# Altium schematic sheet [05] - QSPI FLASH.SchDoc
size A3; DocumentNumber: 5; SheetNumber: 5; SheetTotal: 18
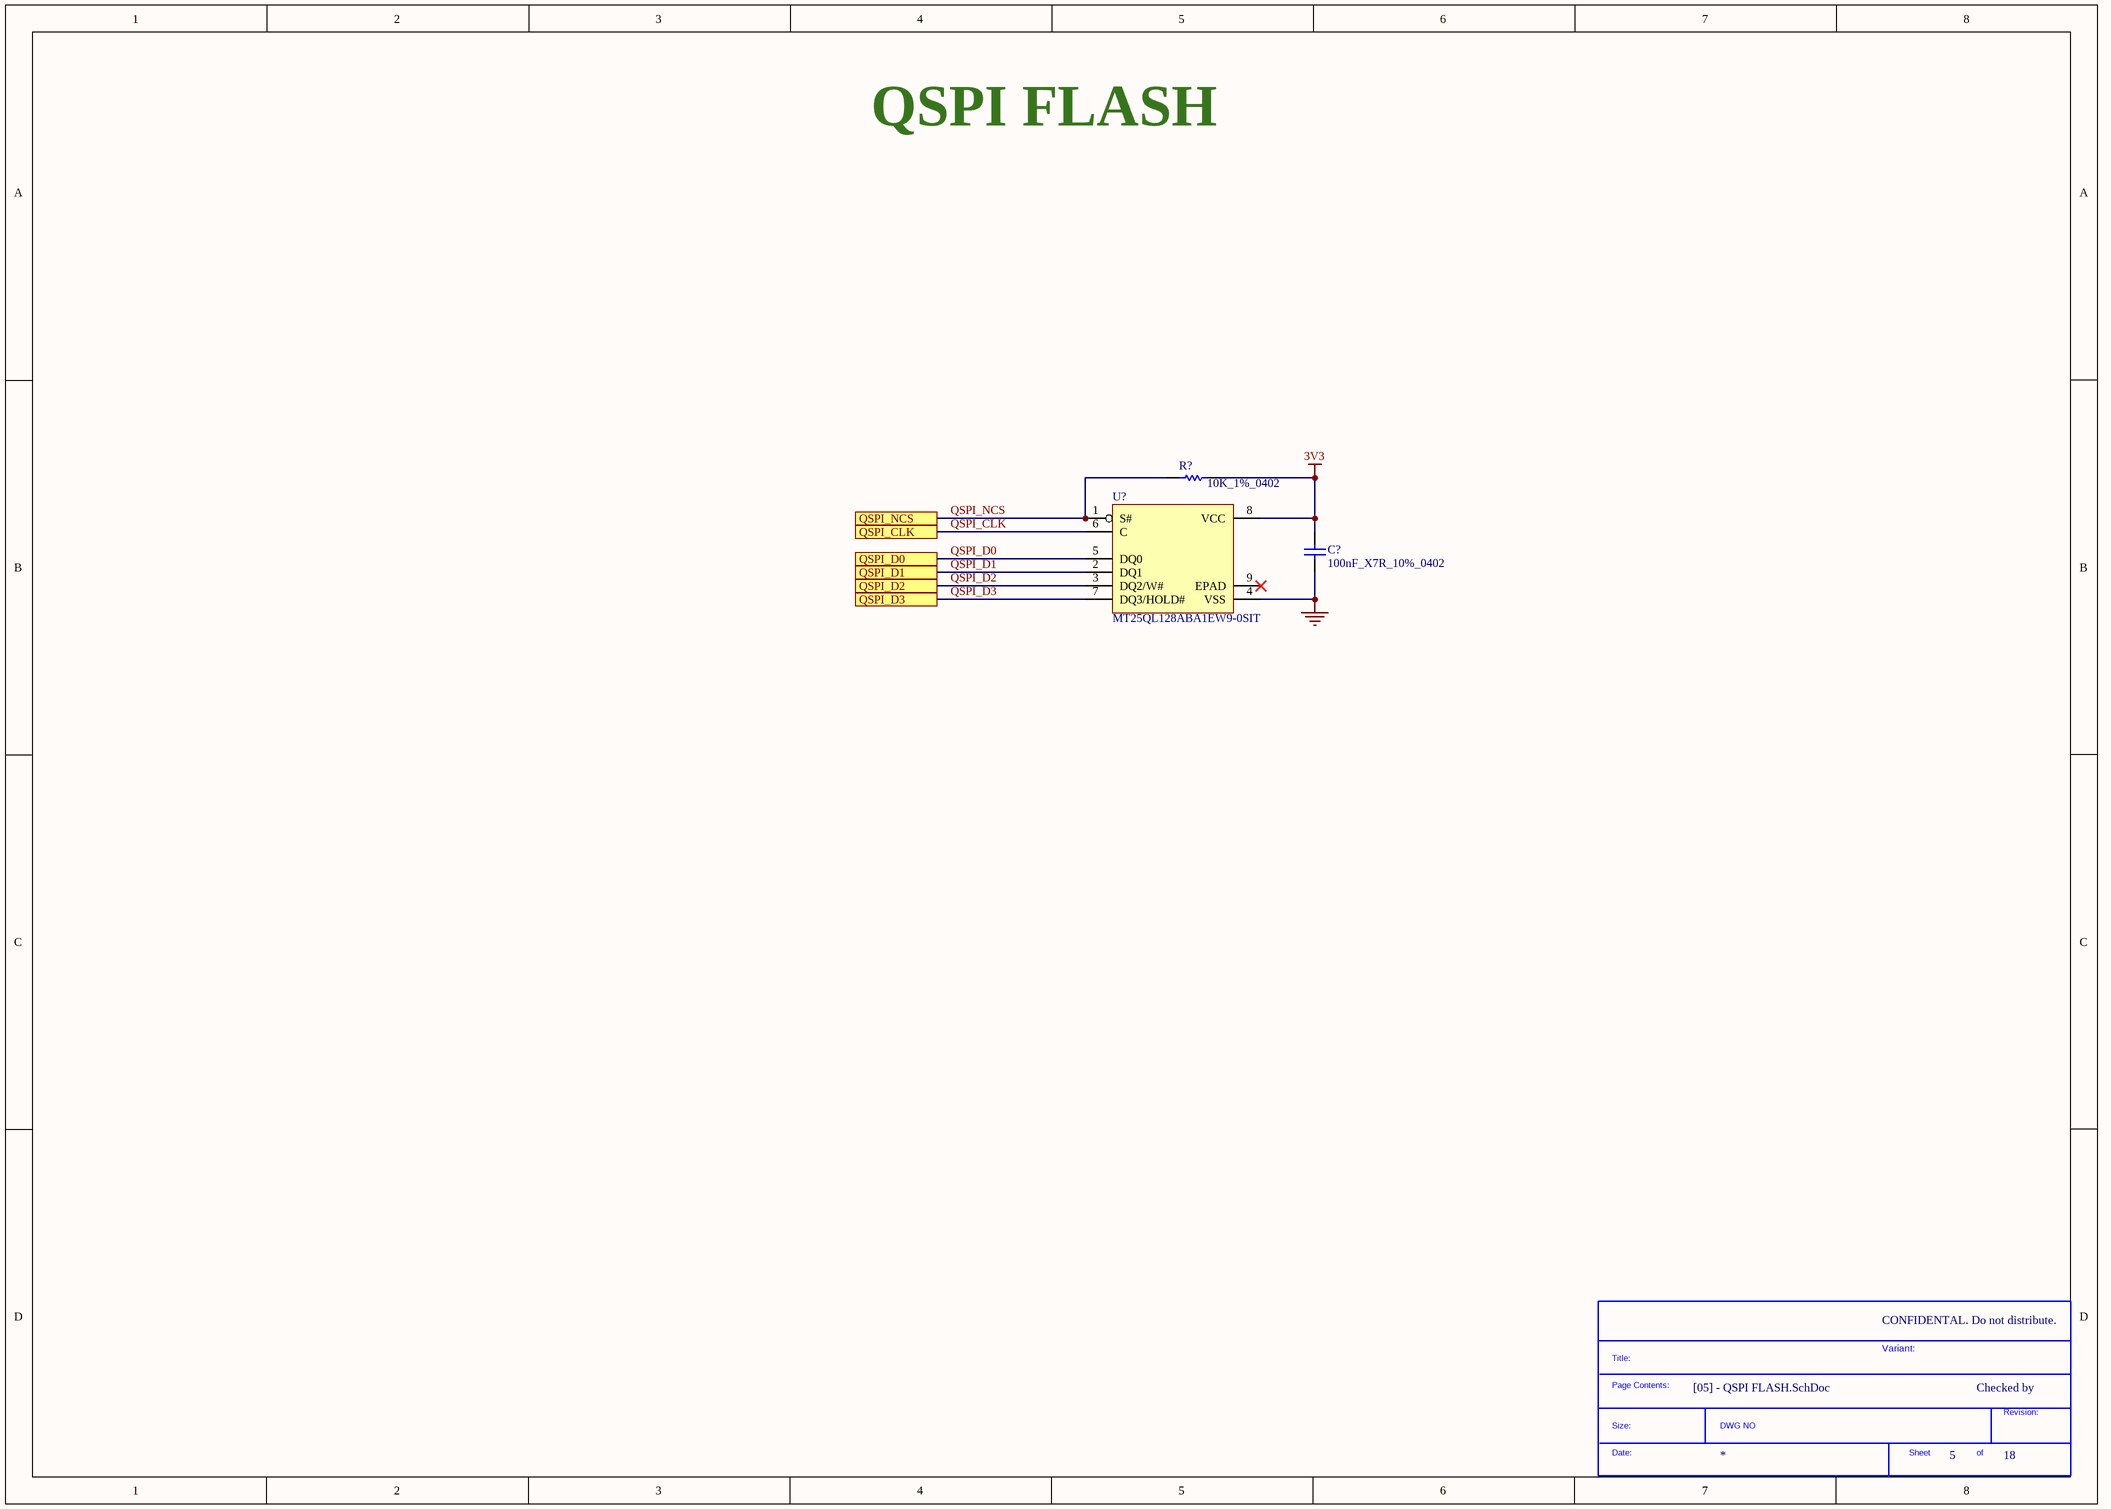
[diagram p0: [05] - QSPI FLASH.SchDoc]

## Parts
*  SDTitleBlock  (value not drawn)  (graphical)
C?  100nF_X7R_10%_0402  [0402C]
R?  10K_1%_0402  [0402R]
U?  MT25QL128ABA1EW9-0SIT  [W-PDFN-8_8X6_P127]

## Ports
QSPI_CLK, QSPI_D0, QSPI_D1, QSPI_D2, QSPI_D3, QSPI_NCS

## Nets
3V3: C?.2 R?.2 U?.8(VCC)
GND: C?.1 U?.4(VSS)
QSPI_CLK: U?.6(C) ; port QSPI_CLK
QSPI_D0: U?.5(DQ0) ; port QSPI_D0
QSPI_D1: U?.2(DQ1) ; port QSPI_D1
QSPI_D2: U?.3(DQ2/W#) ; port QSPI_D2
QSPI_D3: U?.7(DQ3/HOLD#) ; port QSPI_D3
QSPI_NCS: R?.1 U?.1(S#) ; port QSPI_NCS

Not connected (* = marked no-connect by the designer): U? 9(EPAD)*

## Notes on the sheet
- QSPI FLASH
- CONFIDENTAL. Do not distribute.
- CLOCKS (CPU & PCIE)
- Variant:
- Checked by
- (in symbol SDTitleBlock) Title:; Page Contents:; Revision:; Size:; DWG NO; Date:; Sheet; of

## Library data of the parts
C? = Cap_100nF_X7R_10%_0402: Capacitor,100nF,16V,X7R,10%,0402,YAGEO; Manuf_Part_1: CC0402KRX7R7BB104; Revision: July-2002: Re-released for DXP Platform.; Value: 100nF; Order: CC0402KRX7R7BB104; Manuf_1: YAGEO; ECCN_US/EU: n/a
R? = Res_10K_1%_0402: Resistor,10K,0402,1%,YAGEO; Manuf_Part_1: RC0402FR-0710KL; Value: 10K; Manuf_1: YAGEO; Order: RC0402FR-0710KL; ECCN_US/EU: n/a
U? = MT25QL128ABA1EW9-0SIT: 128Mb, 3V, Multiple I/O Serial Flash Memory, Quad/Dual; Manuf_1: MICRON; ECCN_US/EU: 3A991/NEC; Provided: ST; Manuf_Part_1: MT25QL128ABA1EW9-0SIT; Value: MT25QL128ABA1EW9-0SIT